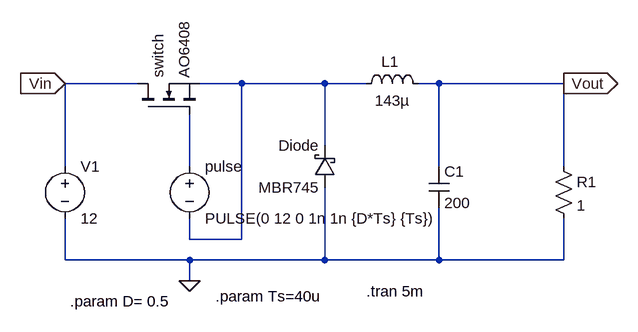
[diagram p0: schematic Buck Not Working.asc]
Buck Not Working.asc, the LTspice schematic file:
Version 4
SHEET 1 880 680
WIRE -272 -112 -384 -112
WIRE -112 -112 -176 -112
WIRE 16 -112 -112 -112
WIRE 80 -112 16 -112
WIRE 192 -112 160 -112
WIRE 384 -112 192 -112
WIRE 16 -16 16 -112
WIRE -384 16 -384 -112
WIRE -192 16 -192 -64
WIRE 192 16 192 -112
WIRE 384 16 384 -112
WIRE -192 128 -192 96
WIRE -112 128 -112 -112
WIRE -112 128 -192 128
WIRE -384 160 -384 96
WIRE -192 160 -384 160
WIRE 16 160 16 48
WIRE 16 160 -192 160
WIRE 192 160 192 80
WIRE 192 160 16 160
WIRE 384 160 384 96
WIRE 384 160 192 160
WIRE -192 192 -192 160
FLAG -384 -112 Vin
IOPIN -384 -112 In
FLAG 384 -112 Vout
IOPIN 384 -112 Out
FLAG -192 192 0
SYMBOL res 368 0 R0
SYMATTR InstName R1
SYMATTR Value 1
SYMBOL voltage -384 0 R0
SYMATTR InstName V1
SYMATTR Value 12
SYMBOL voltage -192 0 R0
WINDOW 123 0 0 Left 0
WINDOW 39 0 0 Left 0
SYMATTR InstName pulse
SYMATTR Value PULSE(0 12 0 1n 1n {D*Ts} {Ts})
SYMBOL schottky 32 48 R180
WINDOW 0 24 64 Left 2
WINDOW 3 24 0 Left 2
SYMATTR InstName Diode
SYMATTR Value MBR745
SYMATTR Description Diode
SYMATTR Type diode
SYMBOL nmos -272 -64 R270
SYMATTR InstName switch
SYMATTR Value AO6408
SYMBOL cap 176 16 R0
SYMATTR InstName C1
SYMATTR Value 200
SYMATTR SpiceLine V=1m
SYMBOL ind 64 -96 R270
WINDOW 0 34 53 VTop 2
WINDOW 3 5 56 VBottom 2
SYMATTR InstName L1
SYMATTR Value 143µ
SYMATTR SpiceLine Ipk=20m
TEXT -376 224 Left 2 !.param D= 0.5
TEXT -152 216 Left 2 !.param Ts=40u
TEXT 80 208 Left 2 !.tran 5m

The netlist it stands for:
* Buck Not Working.asc
R1 Vout 0 1
V1 Vin 0 12
V§pulse N002 N001 PULSE(0 12 0 1n 1n {D*Ts} {Ts})
Diode 0 N001 MBR745
M§switch Vin N002 N001 N001 AO6408
C1 Vout 0 200 V=1m
L1 N001 Vout 143µ Ipk=20m
.model D D
.lib standard.dio
.model NMOS NMOS
.model PMOS PMOS
.lib standard.mos
.param D= 0.5
.param Ts=40u
.tran 5m
.backanno
.end